# Altium schematic sheet DAC.SchDoc
size A4
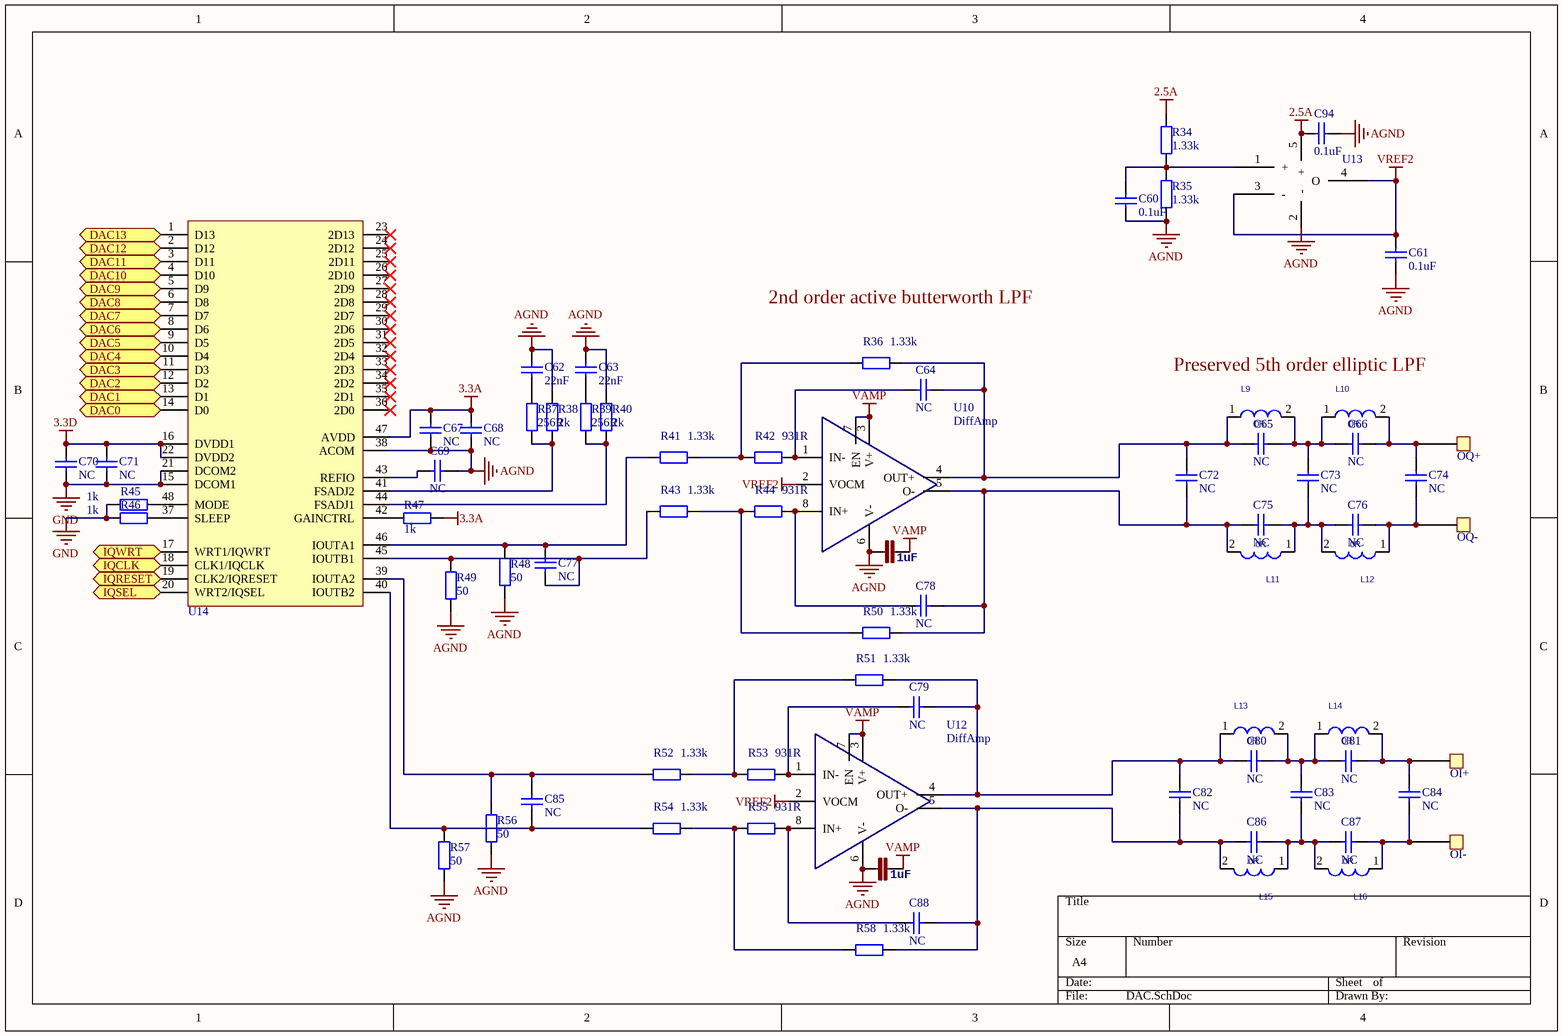
[diagram p0: DAC.SchDoc]

## Parts
C60  0.1uF  [0402]
C61  0.1uF  [0402]
C62  22nF  [0402]
C63  22nF  [0402]
C64  NC  [0402]
C65  NC  [0402]
C66  NC  [0402]
C67  NC  [0603]
C68  NC  [0402]
C69  NC  [0603]
C70  NC  [0402]
C71  NC  [0402]
C72  NC  [0402]
C73  NC  [0402]
C74  NC  [0402]
C75  NC  [0402]
C76  NC  [0402]
C77  NC  [0402]
C78  NC  [0402]
C79  NC  [0402]
C80  NC  [0402]
C81  NC  [0402]
C82  NC  [0402]
C83  NC  [0402]
C84  NC  [0402]
C85  NC  [0402]
C86  NC  [0402]
C87  NC  [0402]
C88  NC  [0402]
C91  1uF  [0603]
C92  1uF  [0603]
C94  0.1uF  [0402]
L9  0R  [0402]
L10  0R  [0402]
L11  0R  [0402]
L12  0R  [0402]
L13  0R  [0402]
L14  0R  [0402]
L15  0R  [0402]
L16  0R  [0402]
OI+  TestPad  [TestPad - 1mm]  (value not drawn)
OI-  TestPad  [TestPad - 1mm]  (value not drawn)
OQ+  TestPad  [TestPad - 1mm]  (value not drawn)
OQ-  TestPad  [TestPad - 1mm]  (value not drawn)
R34  1.33k  [0402]
R35  1.33k  [0402]
R36  1.33k  [0402]
R37  256R  [0402]
R38  2k  [0402]
R39  256R  [0402]
R40  2k  [0402]
R41  1.33k  [0402]
R42  931R  [0402]
R43  1.33k  [0402]
R44  931R  [0402]
R45  1k  [0402]
R46  1k  [0402]
R47  1k  [0402]
R48  50  [0402]
R49  50  [0402]
R50  1.33k  [0402]
R51  1.33k  [0402]
R52  1.33k  [0402]
R53  931R  [0402]
R54  1.33k  [0402]
R55  931R  [0402]
R56  50  [0402]
R57  50  [0402]
R58  1.33k  [0402]
U10  DiffAmp  [MSOP8/VSSOP8]
U12  DiffAmp  [MSOP8/VSSOP8]
U13  OP-SOT23  [SOT23-5]  (value not drawn)
U14  AD9767  [AD9767]  (value not drawn)

## Ports
DAC0, DAC1, DAC2, DAC3, DAC4, DAC5, DAC6, DAC7, DAC8, DAC9, DAC10, DAC11, DAC12, DAC13, IQCLK, IQRESET, IQSEL, IQWRT

## Nets
2.5A: C94.1 R34.1 U13.5(+)
3.3A: C67.1 C68.1 R47.2 U14.47(AVDD)
3.3D: C70.1 C71.1 U14.16(DVDD1) U14.22(DVDD2)
AGND: C60.2 C61.2 C62.1 C63.1 C67.2 C68.2 C69.1 C91.2 C92.2 C94.2 R35.2 R38.2 R40.2 R48.1 R49.2 R56.1 R57.2 U10.6(V-) U12.6(V-) U13.2(-) U14.38(ACOM)
GND: C70.2 C71.2 R45.2 R46.2 U14.15(DCOM1) U14.21(DCOM2)
VAMP: C91.1 C92.1 U10.3(V+) U10.7(EN) U12.3(V+) U12.7(EN)
VREF2: C61.1 U10.2(VOCM) U12.2(VOCM) U13.3(-) U13.4(O)
DAC0: U14.14(D0) ; port DAC0
DAC1: U14.13(D1) ; port DAC1
DAC2: U14.12(D2) ; port DAC2
DAC3: U14.11(D3) ; port DAC3
DAC4: U14.10(D4) ; port DAC4
DAC5: U14.9(D5) ; port DAC5
DAC6: U14.8(D6) ; port DAC6
DAC7: U14.7(D7) ; port DAC7
DAC8: U14.6(D8) ; port DAC8
DAC9: U14.5(D9) ; port DAC9
DAC10: U14.4(D10) ; port DAC10
DAC11: U14.3(D11) ; port DAC11
DAC12: U14.2(D12) ; port DAC12
DAC13: U14.1(D13) ; port DAC13
IQCLK: U14.18(CLK1/IQCLK) ; port IQCLK
IQRESET: U14.19(CLK2/IQRESET) ; port IQRESET
IQSEL: U14.20(WRT2/IQSEL) ; port IQSEL
IQWRT: U14.17(WRT1/IQWRT) ; port IQWRT
NetC60_1: C60.1 R34.2 R35.1 U13.1(+)
NetC62_2: C62.2 R37.2
NetC63_2: C63.2 R39.2
NetC64_1: C64.1 C65.2 C72.2 L9.1 R36.1 U10.4(OUT+)
NetC64_2: C64.2 R42.1 U10.1(IN-)
NetC65_1: C65.1 C66.2 C73.2 L9.2 L10.1
NetC66_1: C66.1 C74.2 L10.2 OQ+.1
NetC69_2: C69.2 U14.43(REFIO)
NetC72_1: C72.1 C75.1 C78.1 L11.2 R50.1 U10.5(O-)
NetC73_1: C73.1 C75.2 C76.1 L11.1 L12.2
NetC74_1: C74.1 C76.2 L12.1 OQ-.1
NetC77_1: C77.1 R41.2 R48.2 U14.46(IOUTA1)
NetC77_2: C77.2 R43.2 R49.1 U14.45(IOUTB1)
NetC78_2: C78.2 R44.1 U10.8(IN+)
NetC79_1: C79.1 C80.2 C82.2 L13.1 R51.1 U12.4(OUT+)
NetC79_2: C79.2 R53.1 U12.1(IN-)
NetC80_1: C80.1 C81.2 C83.2 L13.2 L14.1
NetC81_1: C81.1 C84.2 L14.2 OI+.1
NetC82_1: C82.1 C86.1 C88.1 L15.2 R58.1 U12.5(O-)
NetC83_1: C83.1 C86.2 C87.1 L15.1 L16.2
NetC84_1: C84.1 C87.2 L16.1 OI-.1
NetC85_1: C85.1 R52.2 R56.2 U14.39(IOUTA2)
NetC85_2: C85.2 R54.2 R57.1 U14.40(IOUTB2)
NetC88_2: C88.2 R55.1 U12.8(IN+)
NetR36_2: R36.2 R41.1 R42.2
NetR37_1: R37.1 R38.1 U14.41(FSADJ2)
NetR39_1: R39.1 R40.1 U14.44(FSADJ1)
NetR43_1: R43.1 R44.2 R50.2
NetR45_1: R45.1 U14.48(MODE)
NetR46_1: R46.1 U14.37(SLEEP)
NetR47_1: R47.1 U14.42(GAINCTRL)
NetR51_2: R51.2 R52.1 R53.2
NetR54_1: R54.1 R55.2 R58.2

Not connected (* = marked no-connect by the designer): U14 23(2D13)* 24(2D12)* 25(2D11)* 26(2D10)* 27(2D9)* 28(2D8)* 29(2D7)* 30(2D6)* 31(2D5)* 32(2D4)* 33(2D3)* 34(2D2)* 35(2D1)* 36(2D0)*

## Notes on the sheet
- 2nd order active butterworth LPF
- Preserved 5th order elliptic LPF

## Library data of the parts
C60-C88 C94 = Cap: Capacitor; Published: 8-Jun-2000; LatestRevisionDate: 17-Jul-2002; LatestRevisionNote: Re-released for DXP Platform.; PackageReference: RAD-0.3; Publisher: Altium Limited; PackageDescription: Radial Cap, Thru-Hole; 2 Leads; 0.3 in Pin Spacing
C91 C92 = CAP0402-CAP: <b>Capacitor</b> / Standard 0603 ceramic capacitor, and 0.1" leaded capacitor.; PARTNO: CC0402ZRY5V7BB104
L9-L16 = L/2.5*2.0
R34-R58 = Res2: Resistor; Value: 0Ohm; Published: 8-Jun-2000; LatestRevisionDate: 17-Jul-2002; LatestRevisionNote: Re-released for DXP Platform.; PackageReference: AXIAL-0.4; Publisher: Altium Limited; PackageDescription: Axial Device, Thru-Hole; 2 Leads; 0.4 in Pin Spacing